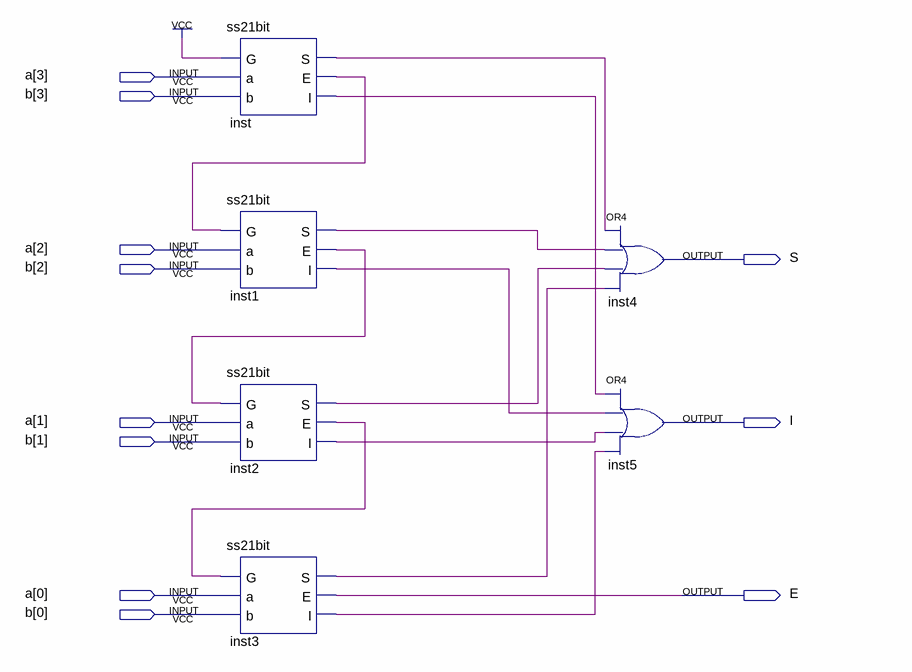
[diagram p0: schematic sheet]
// Quartus schematic ss24bit.bdf as structural Verilog: 6 symbols, 11 pins
module ss24bit (
  input  [3:0] a,
  input  [3:0] b,
  output S,
  output I,
  output E
);

  wire inst1_e, inst1_i, inst1_s, inst2_e, inst2_i, inst2_s, inst3_i, inst3_s, inst_e, inst_i, inst_s;

  ss21bit inst (.G(1'b1), .a(a[3]), .b(b[3]), .S(inst_s), .E(inst_e), .I(inst_i));
  ss21bit inst1 (.G(inst_e), .a(a[2]), .b(b[2]), .S(inst1_s), .E(inst1_e), .I(inst1_i));
  ss21bit inst2 (.G(inst1_e), .a(a[1]), .b(b[1]), .S(inst2_s), .E(inst2_e), .I(inst2_i));
  ss21bit inst3 (.G(inst2_e), .a(a[0]), .b(b[0]), .S(inst3_s), .E(E), .I(inst3_i));
  or inst4 (S, inst_s, inst1_s, inst2_s, inst3_s);
  or inst5 (I, inst_i, inst1_i, inst2_i, inst3_i);
endmodule
